# Altium schematic sheet MCU.SchDoc
size A4; SheetNumber: 2; SheetTotal: 13
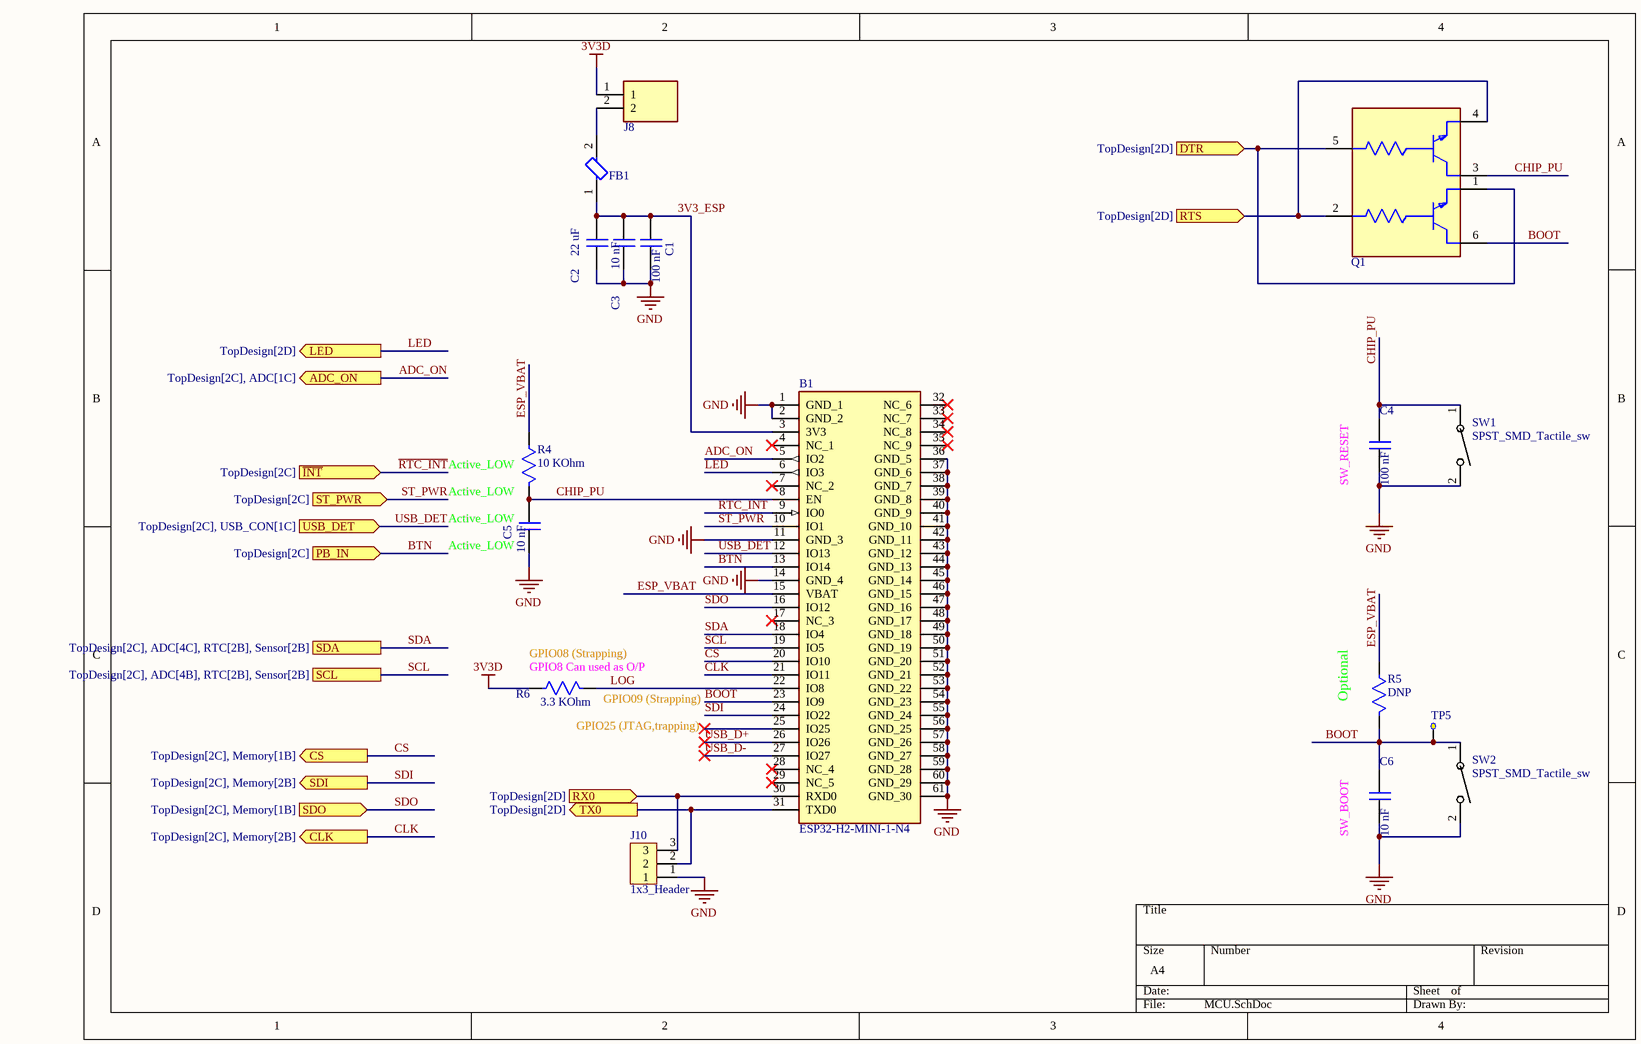
[diagram p0: MCU.SchDoc]

## Parts
B1  ESP32-H2-MINI-1-N4  [ESP32-H2-MINI-1-NX]
C1  100 nF  [CAP_0603]
C2  22 uF  [CAP_0603]
C3  10 nF  [CAP_0603]
C4  100 nF  [CAP_0603]
C5  10 nF  [CAP_0603]
C6  10 nF  [CAP_0603]
FB1  BLM18KG601SN1D  [FBead_Murata_BLM18KG601SN1D]  (value not drawn)
J8  Pin_Header_2.54_2P  [Pin_Header_2.54_2P]  (value not drawn)
J10  1x3_Header  [1x3_Header]
Q1  UMH3NTN-(Dual Transistor With Base Res)  [UMH3NTN-(Dual Transistor With Base Res-SOT-363)]  (value not drawn)
R4  10 KOhm  [Res_0603]
R5  DNP  [Res_0603]
R6  3.3 KOhm  [Res_0603]
SW1  SPST_SMD_Tactile_sw  [SPST_SMD_6mm]
SW2  SPST_SMD_Tactile_sw  [SPST_SMD_6mm]
TP5  boot  [Test_Point]  (value not drawn)

## Ports
ADC_ON (out, see TopDesign[2C], ADC[1C]), CLK (out, see TopDesign[2C], Memory[2B]), CS (out, see TopDesign[2C], Memory[1B]), DTR (in, see TopDesign[2D]), LED (out, see TopDesign[2D]), PB_IN (in, see TopDesign[2C]), RTS (in, see TopDesign[2D]), RX0 (in, see TopDesign[2D]), SCL (see TopDesign[2C], ADC[4B], RTC[2B], Sensor[2B]), SDA (see TopDesign[2C], ADC[4C], RTC[2B], Sensor[2B]), SDI (out, see TopDesign[2C], Memory[2B]), SDO (in, see TopDesign[2C], Memory[1B]), ST_PWR (in, see TopDesign[2C]), TX0 (out, see TopDesign[2D]), USB_DET (in, see TopDesign[2C], USB_CON[1C]), ~{INT} (in, see TopDesign[2C])

## Nets
3V3D: J8.1 R6.2
GND: B1.1(GND_1) B1.2(GND_2) B1.11(GND_3) B1.14(GND_4) B1.36(GND_5) B1.37(GND_6) B1.38(GND_7) B1.39(GND_8) B1.40(GND_9) B1.41(GND_10) B1.42(GND_11) B1.43(GND_12) B1.44(GND_13) B1.45(GND_14) B1.46(GND_15) B1.47(GND_16) B1.48(GND_17) B1.49(GND_18) B1.50(GND_19) B1.51(GND_20) B1.52(GND_21) B1.53(GND_22) B1.54(GND_23) B1.55(GND_24) B1.56(GND_25) B1.57(GND_26) B1.58(GND_27) B1.59(GND_28) B1.60(GND_29) B1.61(GND_30) C1.1 C2.1 C3.1 C4.1 C5.1 C6.1 J10.1 SW1.2 SW2.2
3V3_ESP: B1.3(3V3) C1.2 C2.2 C3.2 FB1.1
ADC_ON: B1.5(IO2) ; port ADC_ON
BOOT: B1.23(IO9) C6.2 Q1.6(C) R5.1 SW2.1 TP5.TP?(Ref_Point)
BTN: B1.13(IO14) ; port PB_IN
CHIP_PU: B1.8(EN) C4.2 C5.2 Q1.3(C) R4.1 SW1.1
CLK: B1.21(IO11) ; port CLK
CS: B1.20(IO10) ; port CS
DTR: Q1.1(E) Q1.5(B) ; port DTR
ESP_VBAT: B1.15(VBAT) R4.2 R5.2
LED: B1.6(IO3) ; port LED
LOG: B1.22(IO8) R6.1
~{RTC_INT}: B1.9(IO0) ; port ~{INT}
RTS: Q1.2(B) Q1.4(E) ; port RTS
RX0: B1.30(RXD0) J10.3 ; port RX0
SCL: B1.19(IO5) ; port SCL
SDA: B1.18(IO4) ; port SDA
SDI: B1.24(IO22) ; port SDI
SDO: B1.16(IO12) ; port SDO
ST_PWR: B1.10(IO1) ; port ST_PWR
TX0: B1.31(TXD0) J10.2 ; port TX0
USB_D+: B1.26(IO26)
USB_D-: B1.27(IO27)
USB_DET: B1.12(IO13) ; port USB_DET
NetFB1_2: FB1.2 J8.2

Not connected (* = marked no-connect by the designer): B1 4(NC_1)* 7(NC_2)* 17(NC_3)* 25(IO25)* 28(NC_4)* 29(NC_5)* 32(NC_6)* 33(NC_7)* 34(NC_8)* 35(NC_9)*

## Notes on the sheet
- Active_LOW
- (near R4) Active_LOW
- (near C4) SW_RESET
- (near C5) Active_LOW
- (near R6) GPIO08 (Strapping)
- (near R6) GPIO8 Can used as O/P
- (near R6) GPIO25 (JTAG,trapping)
- (near R6) GPIO09 (Strapping)
- (near R5) Optional
- (near C6) SW_BOOT

## Library data of the parts
B1 = ESP32-H2-MINI-1-XX: Multiprotocol Modules ENGINEERING SAMPLE Bluetooth Low Energy and IEEE 802.15.4  module with ESP32-H2 chip; Manufacturer_Name: Espressif Systems; Geometry.Height: 2.55mm; Manufacturer_Part_Number: ESP32-H2-MINI-1-N4; Datasheet Link: https://www.espressif.com/sites/default/files/documentation/esp32-h2-mini-1_mini-1u_datasheet_en.pdf; LCSC: N-C18203134/U-C22470215
C1-C6 = Cap SMD: Cap SMD.
J8 = Pin_Header_2.54_2P: Pin_Header_2.54_2P_Straight; Manufacturer_Name: Wurth Elektronik; Manufacturer_Part_Number: 61300211121; Geometry.Height: 8.54mm; Datasheet Link: https://componentsearchengine.com/Datasheets/2/61300211121.pdf; LCSC: C492401
Q1 = UMH3NTN-(Dual Transistor With Base Res): UMH3NTN-(Dual Transistor With Base Res = 4.7K) , 100@1mA,5V 150mW 100mA 50V SOT-363 Digital Transistors ROHS; MPN: ROHM; MFPN: UMH3NTN; Datasheet: https://www.lcsc.com/datasheet/C123008.pdf; LCSC: C123008
R4-R6 = Res smd: SMD Resistor; MP: RC0805FR-07330RL; MF: Yageo; Package: 2012 Rohm Semiconductor; Value: *; SnapEDA_Link: https://www.snapeda.com/parts/RC0805FR-07330RL/Yageo/view-part/106115/?ref=snap; Price: None; Availability: Unavailable
SW1 SW2 = SPST_SMD_Tactile_sw: SPST SMD Tactile Switches Rectangle button Brick nogging; Mfr_Name: XKB Connectivity
TP5 = Test_Point